# EAGLE design Blinder_v1 (EAGLE 5.11)
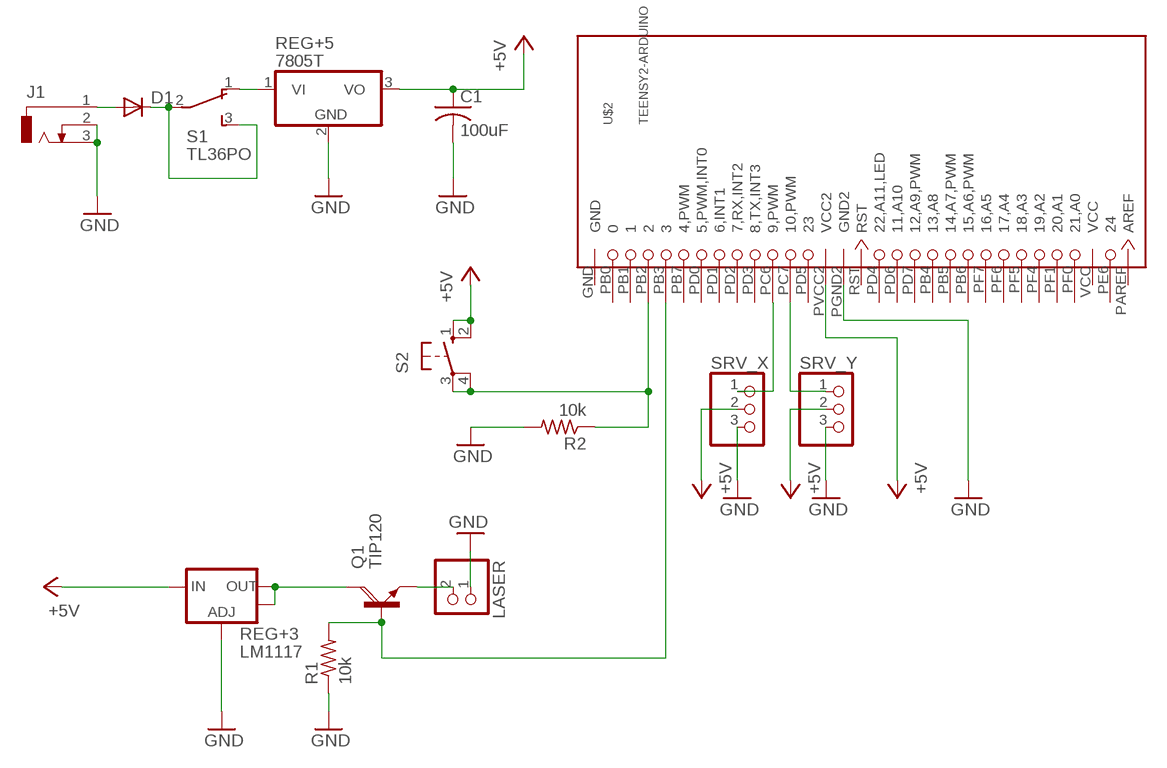
[diagram p0: schematic, sheet 1]

## Parts
C1  100uF  C-US025-050X050  [C025-050X050]
D1  DIODE-D-7.5  [D-7.5]
J1  DCJ0303  [DCJ0303]
LASER  PINHD-1X2/90  [1X02/90]
Q1  TIP120  [TO220AH]
R1  10k  R-US_0204/5  [0204/5]
R2  10k  R-US_0204/5  [0204/5]
REG+3  LM1117  V_REG_LM1117SOT223  [SOT223]
REG+5  7805T  [TO220H]
S1  TL36PO  [TL3XPO]
S2  10-XX  [B3F-10XX]
SRV_X  PINHD-1X3/90  [1X03/90]
SRV_Y  PINHD-1X3/90  [1X03/90]
U$2  TEENSY2-ARDUINO  [TEENSY2]

## Nets
+5V: C1.1 REG+3.3(IN) REG+5.3(VO) S2.1(S) S2.2(S1) SRV_X.2 SRV_Y.2 U$2.PVCC2(VCC2)
GND: C1.2 J1.2 J1.3 LASER.1 R1.1 R2.2 REG+3.1(ADJ) REG+5.2(GND) SRV_X.3 SRV_Y.3 U$2.PGND2(GND2)
N$1: D1.A J1.1
N$2: Q1.C REG+3.2(OUT) REG+3.4(OUT)
N$3: LASER.2 Q1.E
N$4: Q1.B R1.2 U$2.PB3
N$5: SRV_X.1 U$2.PC6(9,PWM)
N$6: SRV_Y.1 U$2.PC7(10,PWM)
N$7: D1.C S1.2(P) S1.3(S)
N$8: REG+5.1(VI) S1.1(O)
N$9: R2.1 S2.3(P) S2.4(P1) U$2.PB2
Unconnected: U$2.PAREF(AREF) U$2.PB0 U$2.PB1 U$2.PB4(13,A8) U$2.PB5(14,A7,PWM) U$2.PB6(15,A6,PWM) U$2.PB7(4,PWM) U$2.PD0(5,PWM,INT0) U$2.PD1(6,INT1) U$2.PD2(7,RX,INT2) U$2.PD3(8,TX,INT3) U$2.PD4(22,A11,LED) U$2.PD5 U$2.PD6(11,A10) U$2.PD7(12,A9,PWM) U$2.PE6 U$2.PF0(21,A0) U$2.PF1(20,A1) U$2.PF4(19,A2) U$2.PF5(18,A3) U$2.PF6(17,A4) U$2.PF7(16,A5) U$2.RST

## Power pins joined to a net without a drawn wire
GND: U$2.GND
VCC: U$2.VCC

## Library data of the parts
C1 = rcl:C-US: CAPACITOR, American symbol
D1 = diode:DIODE-: DIODE
J1 = con-jack:DCJ0303: DC POWER JACK Source: DCJ0303.pdf; OC_FARNELL: unknown; OC_NEWARK: unknown
LASER = pinhead:PINHD-1X2: PIN HEADER
Q1 = transistor-power:TIP120: NPN DARLINGTON TRANSISTOR
R1 R2 = rcl:R-US_: RESISTOR, American symbol
REG+3 = SparkFun:V_REG_LM1117: Voltage Regulator LM1117 Standard adjustable voltage regulator but in SMD form. Spark Fun Electronics SKU : COM-00595
REG+5 = linear:78*: Positive VOLTAGE REGULATOR Source: http://cache.national.com/ds/LM/LM78L05.pdf http://www.fairchildsemi.com/ds/LM/LM7805.pdf
S1 = switch:TL36PO: TINY SWITCH ON - ON Source: http://www2.produktinfo.conrad.com/datenblaetter/700000-724999/705152-da-01-de-Subminiaturschalter_TL_36YO.pdf
S2 = switch-omron:10-XX: OMRON SWITCH; MPN: B3F-1000; OC_FARNELL: 176432; OC_NEWARK: 36M3542
SRV_X SRV_Y = pinhead:PINHD-1X3: PIN HEADER
U$2 = teensy2:TEENSY2-ARDUINO

## Board
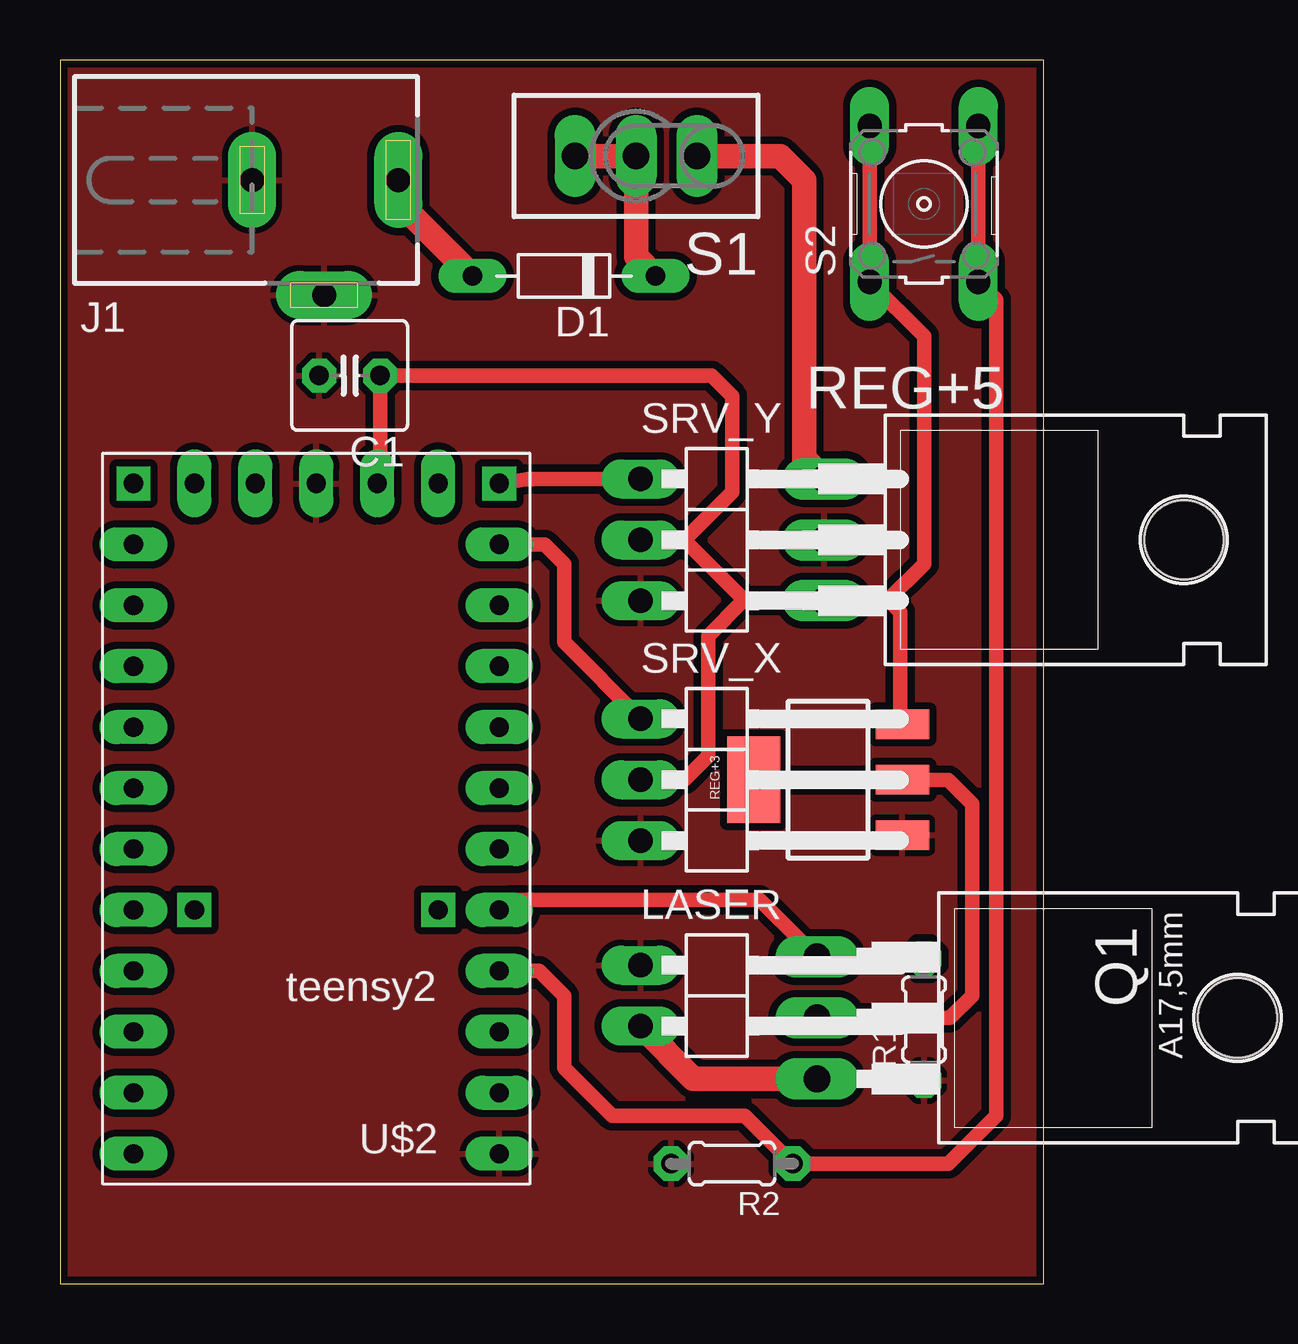
[diagram p1: board, top side]

Size 41 x 51 mm. Coordinates in mm from the lower left corner, seen from the top.
Outline: 0,0 41,0 41,51 0,51 0,0
Copper layers (1*16): Top 0.0356mm / dielectric 1.5011mm / Bottom 0.0356mm
Design rules "SparkFun-mod": minimum track width 8mil, minimum drill 20mil, track to track 12mil, track to pad 12mil, pad to pad 8mil, via to via 8mil, smd to smd 8mil, copper to edge 12mil, drill to drill 8mil, minimum pad ring 12mil, minimum via ring 10mil, stop-mask expansion 4mil, vias tented up to drill 25mil, thermal gap 10mil

### Footprints (pad centres in the part's own frame; a part is rotated, then mirrored left to right if it is on the bottom)
C025-050X050 = drill 0.813 octagon: 1 -1.27,0; 2 1.27,0
D-7.5 = drill 0.813 long: A 3.81,0; C -3.81,0
DCJ0303 = drill 1 pad 2 long: 1 0,3.1; 2 4.8,0; 3 0,-3
1X02/90 = drill 1.016 long: 1 -1.27,-3.81; 2 1.27,-3.81
TO220AH = drill 1.118 long: B -2.54,-6.35; C 0,-6.35; E 2.54,-6.35 | hole 3.302: 0,11.176
0204/5 = drill 0.813 octagon: 1 -2.54,0; 2 2.54,0
SOT223 = smd 1.219 x 2.235: 1 -2.311,-3.099; 2 0,-3.099; 3 2.311,-3.099 | smd 3.6 x 2.2: 4 0,3.099
TO220H = drill 1.118 long: 1 -2.54,-10.16; 2 0,-10.16; 3 2.54,-10.16 | hole 3.302: 0,4.826
TL3XPO = drill 1.1 pad 1.422 long: 1 -2.54,0; 2 0,0; 3 2.54,0
B3F-10XX = drill 1.016 long: 1 -3.251,2.261; 2 3.251,2.261; 3 -3.251,-2.261; 4 3.251,-2.261
1X03/90 = drill 1.016 long: 1 -2.54,-3.81; 2 0,-3.81; 3 2.54,-3.81
TEENSY2 = drill 0.8 long: GND 12.7,21.59; PB0 12.7,19.05; PB1 12.7,16.51; PB2 12.7,13.97; PB3 12.7,11.43; PB4 27.94,-1.27; PB5 27.94,1.27; PB6 27.94,3.81; PB7 12.7,8.89; PC6 12.7,-3.81; PD0 12.7,6.35; PD1 12.7,3.81; PD2 12.7,1.27; PD3 12.7,-1.27; PD4 25.4,-6.35; PD5 15.24,-6.35; PD7 27.94,-3.81; PF0 27.94,19.05; PF1 27.94,16.51; PF4 27.94,13.97; PF5 27.94,11.43; PF6 27.94,8.89; PF7 27.94,6.35; PGND2 20.32,-6.35; PVCC2 17.78,-6.35; RST 22.86,-6.35; VCC 27.94,21.59 | drill 0.8 square: PAREF 25.4,11.43; PC7 12.7,-6.35; PD6 27.94,-6.35; PE6 15.24,11.43

### Placement (x,y rotation side)
C1  12.07,37.85 180 top
D1  21,42 180 top
J1  11,46 270 top
LASER  28,12 270 top
Q1  37.89,11.07 270 top
R1  36,11 90 top
R2  28,5 180 top
REG+3  32,21 90 top
REG+5  42,31 270 top
S1  24,47 180 top
S2  36,45 90 top
SRV_X  28,21 270 top
SRV_Y  28,31 270 top
U$2  31,27 180 top

### Tracks (layer width: path | path; a pad name or v marks a point on that pad's centre or on a via)
+5V
  Top 0.61: S2.2 S2.1 36,39.49 36,30 34.46,28.46 REG+5.3 | SRV_X.2 26,21 27,22 27,27 28.46,28.46 REG+5.3 | REG+3.3 35,23.41 35,28 34.54,28.46 REG+5.3 | U$2.PVCC2 13.34,33.47 C1.1 27.15,37.85 28,37 28,33 26,31 | 26,31 SRV_Y.2 | 26,31 28.54,28.46 REG+5.3
GND
  pour Top (isolate 0.305): 0,51 41,51 41,0 0,0
N$1
  Top 1.016: J1.1 14.1,45.09 D1.A
N$2
  Top 0.61: Q1.C 37.07,11.07 38,12 38,20 37,21 REG+3.2 REG+3.4
N$3
  Top 1.016: LASER.2 26.39,8.53 Q1.E
N$4  (1 unrouted)
  Top 0.61: Q1.B 29.15,16 18.73,16 U$2.PB3
  Top 1.016: R1.2 35.93,13.61
N$5
  Top 0.61: SRV_X.1 21,26.73 21,30 20.19,30.81 U$2.PC6
N$6
  Top 0.61: U$2.PC7 19.49,33.54 SRV_Y.1
N$7
  Top 1.016: S1.3 S1.2 24,42.81 D1.C
N$8
  Top 1.016: S1.1 30,47 31,46 31,34.38 REG+5.1
N$9
  Top 0.61: S2.4 S2.3 39,41.01 39,7 37,5 R2.1 28.54,7 23,7 21,9 21,12 19.97,13.03 U$2.PB2